# EAGLE design 8296_diag_KB (EAGLE 9.6.2)
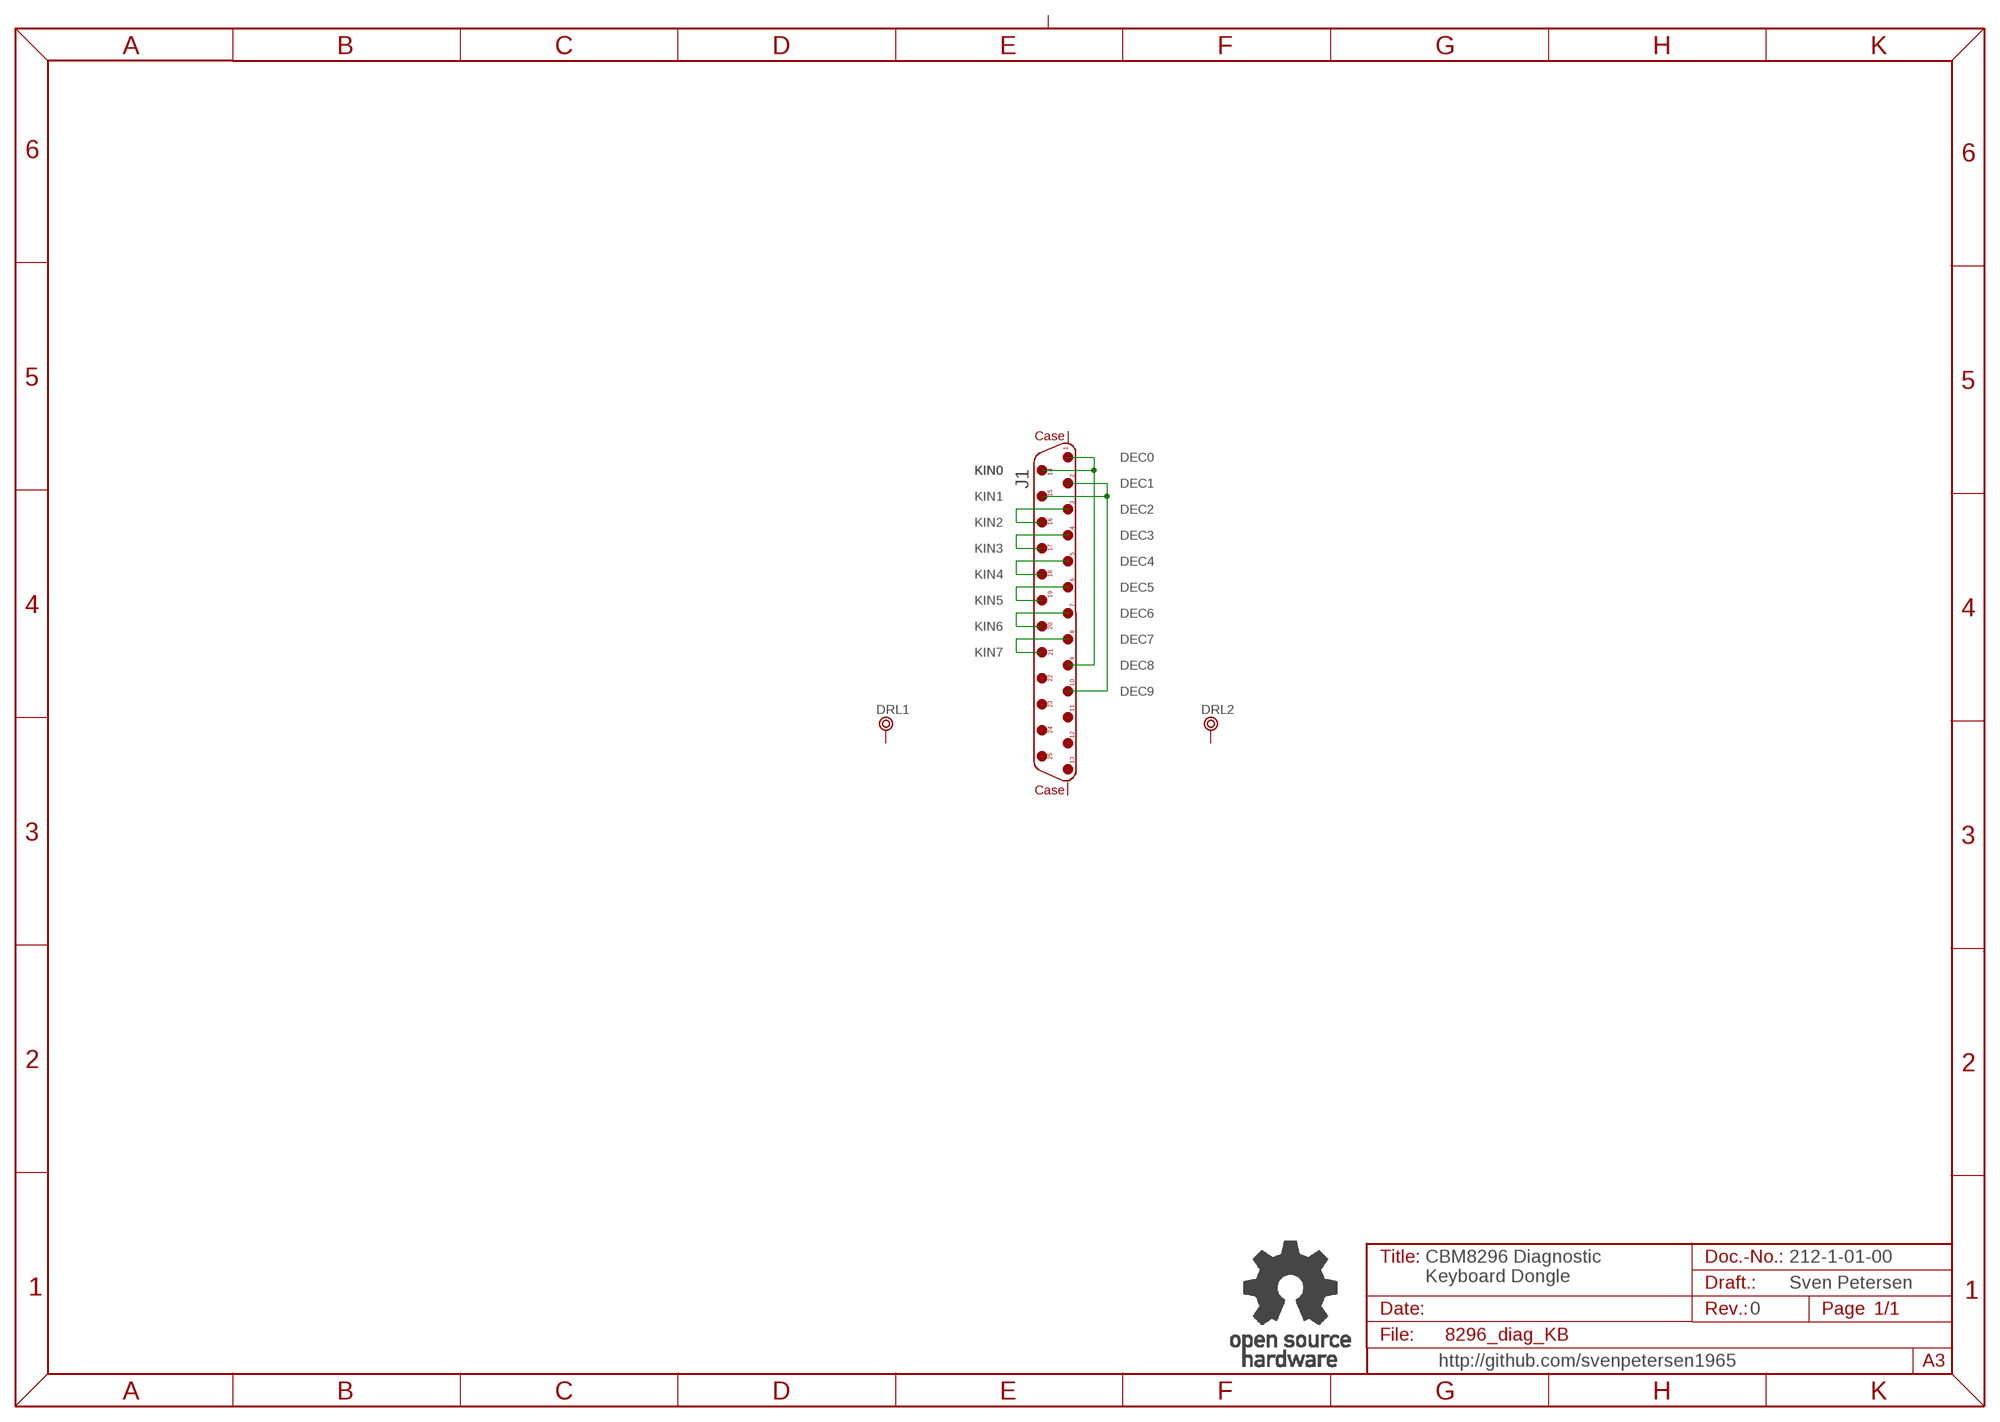
[diagram p0: schematic, sheet 1]

## Parts
DRL1  BOHR3,5  [BOHR3,5]
DRL2  BOHR3,5  [BOHR3,5]
J1  D25M90CLEU  [D25M90CLEU]
U$13  OPEN_SOURCE_HW  [OPENHW]

## Nets
N$1: J1.1 J1.9 J1.14
N$2: J1.2 J1.10 J1.15
N$3: J1.3 J1.16
N$4: J1.4 J1.17
N$5: J1.5 J1.18
N$6: J1.6 J1.19
N$7: J1.7 J1.20
N$8: J1.8 J1.21
Unconnected: DRL1.P$1 DRL2.P$1 J1.11 J1.12 J1.13 J1.22 J1.23 J1.24 J1.25 J1.PE1(CL1) J1.PE2(CL2)

## Notes on the sheet
- DEC0
- KIN0 | KIN0
- DEC1
- KIN1
- DEC2
- KIN2
- DEC3
- KIN3
- DEC4
- KIN4
- DEC5
- KIN5
- DEC6
- KIN6
- DEC7
- KIN7
- DEC8
- DEC9
- 212-1-01-00
- CBM8296 Diagnostic
  Keyboard Dongle
- Sven Petersen
- 0
- http://github.com/svenpetersen1965

## Library data of the parts
DRL1 DRL2 = Mech_Bohr:BOHR3,5
J1 = Connect:D25M90CL
U$13 = Logo:OPEN_SOURCE_HW

## Board
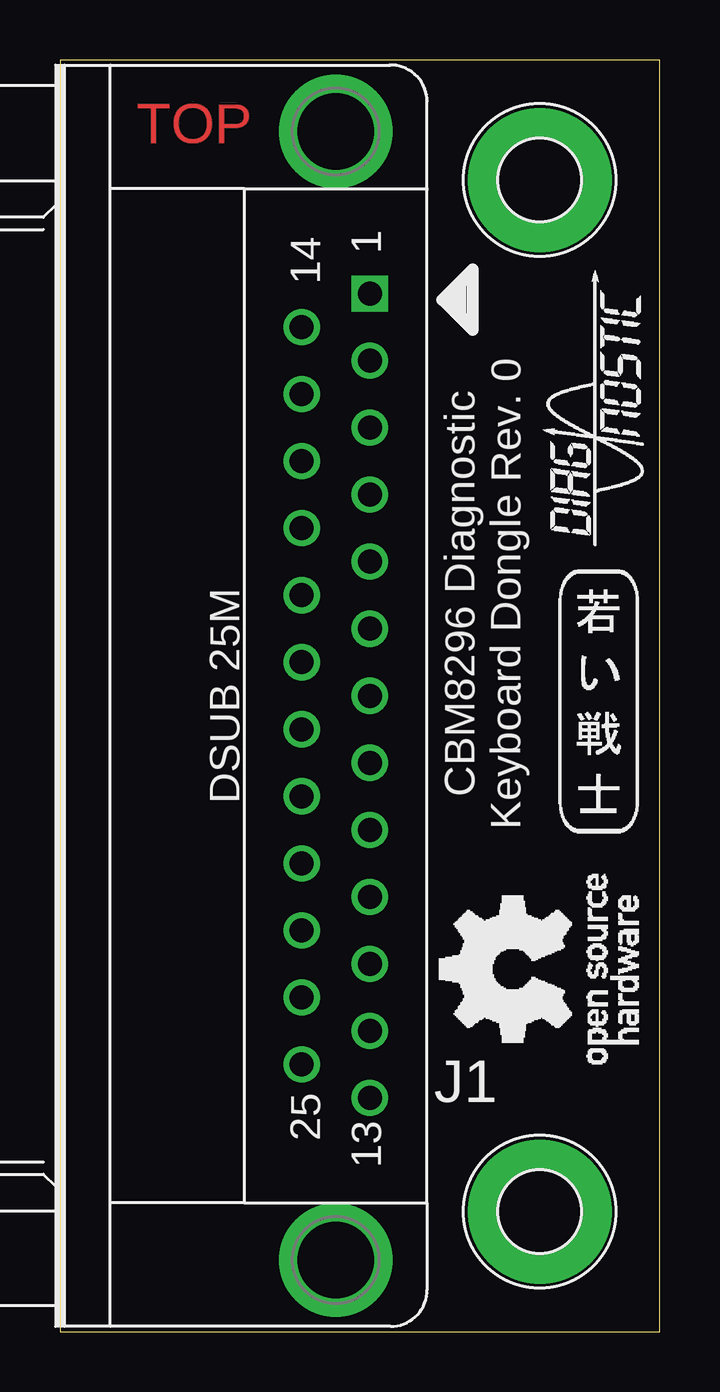
[diagram p1: board, top side]
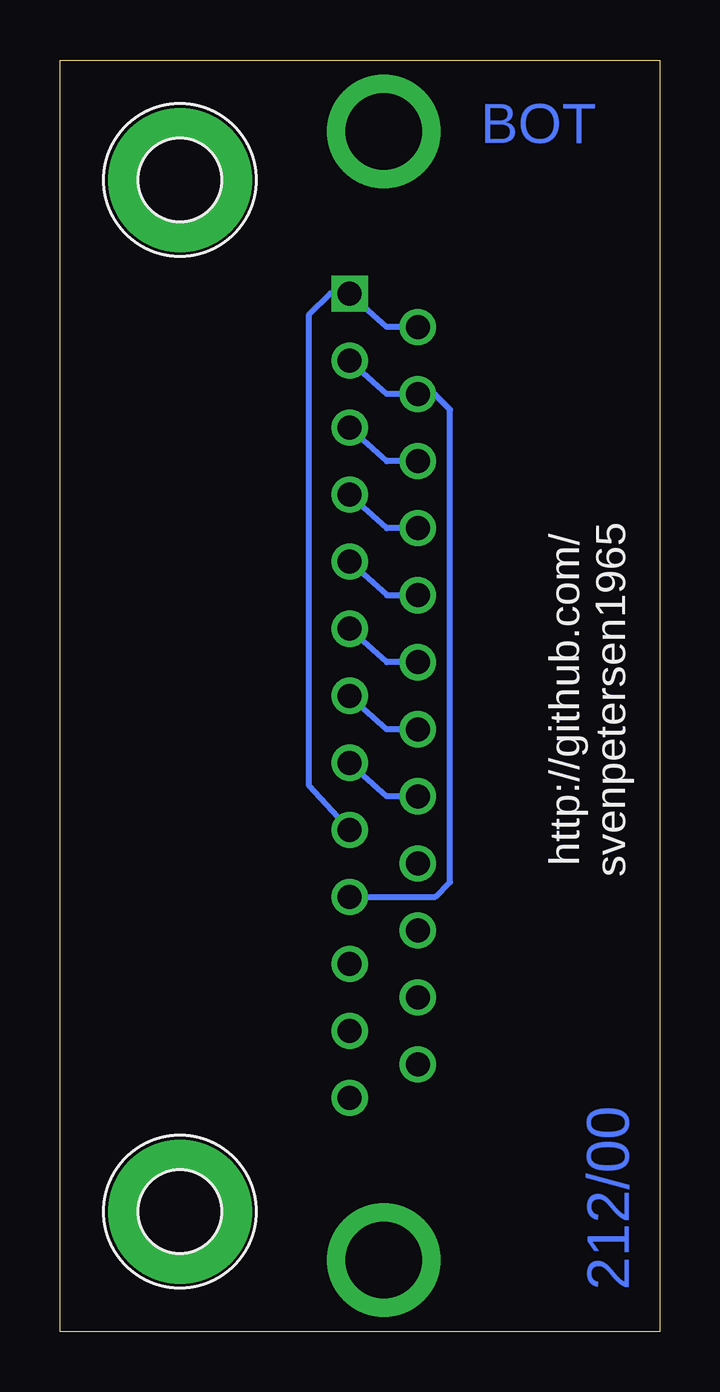
[diagram p2: board, bottom side, seen from below]

Size 25 x 53 mm. Coordinates in mm from the lower left corner, seen from the top.
Outline: 0,0 25,0 25,53 0,53 0,0
Copper layers (1*16): Top 0.035mm / dielectric 1.5mm / Bottom 0.035mm
Design rules "default *": minimum track width 6mil, minimum drill 0.35mm, track to track 6mil, track to pad 6mil, pad to pad 6mil, via to via 6mil, smd to smd 6mil, copper to edge 40mil, drill to drill 6mil, minimum pad ring 10mil, minimum via ring 8mil, stop-mask expansion 4mil, vias tented up to drill 25mil, thermal gap 10mil

### Footprints (pad centres in the part's own frame; a part is rotated, then mirrored left to right if it is on the bottom)
BOHR3,5 = drill 3.5 pad 6: P$1 0,0
D25M90CLEU = drill 1 square: 1 16.764,-1.42 | drill 1: 2 13.97,-1.42; 3 11.176,-1.42; 4 8.382,-1.42; 5 5.588,-1.42; 6 2.794,-1.42; 7 0,-1.42; 8 -2.794,-1.42; 9 -5.588,-1.42; 10 -8.382,-1.42; 11 -11.176,-1.42; 12 -13.97,-1.42; 13 -16.764,-1.42; 14 15.367,1.42; 15 12.573,1.42; 16 9.779,1.42; 17 6.985,1.42; 18 4.191,1.42; 19 1.397,1.42; 20 -1.397,1.42; 21 -4.191,1.42; 22 -6.985,1.42; 23 -9.779,1.42; 24 -12.573,1.42; 25 -15.367,1.42 | drill 3.2 pad 4.724: PE1 23.52,0; PE2 -23.52,0

### Placement (x,y rotation side)
DRL1  20,48 0 top
DRL2  20,5 0 top
J1  11.5,26.5 90 top
U$2  [DIAG_SMALL]  24.34,32.7 90 top
U$3  [SVEN_TAG]  22.5,26.38 0 top
U$4  [2LAYER]  3.17,49.53 0 top
U$5  [PCB-TITLE/]  0,60.96 0 top  (outside the outline)
U$13  24.1,11.17 90 top

### Tracks (layer width: path | path; a pad name or v marks a point on that pad's centre or on a via)
N$1
  Bottom 0.254: J1.14 11.37,41.87 J1.1 13.73,43.26 14.61,42.39 14.61,22.75 J1.9
N$2
  Bottom 0.254: J1.2 11.37,39.07 J1.15 9.39,39.07 8.73,38.42 8.73,18.73 9.35,18.12 J1.10
N$3
  Bottom 0.254: J1.16 11.37,36.28 J1.3
N$4
  Bottom 0.254: J1.17 11.37,33.48 J1.4
N$5
  Bottom 0.254: J1.5 11.37,30.69 J1.18
N$6
  Bottom 0.254: J1.19 11.37,27.9 J1.6
N$7
  Bottom 0.254: J1.20 11.37,25.1 J1.7
N$8
  Bottom 0.254: J1.21 11.37,22.31 J1.8

### Text on the board
Bottom: 212/00
tNames: CBM8296 Diagnostic / Keyboard Dongle Rev. 0 | DSUB 25M
bNames: http://github.com/ / svenpetersen1965
Document: 212-2-01-00 | Sven Petersen / 2023 | 35µm | 2 | 0